# EAGLE design schemat_lite (EAGLE 8.3.0)
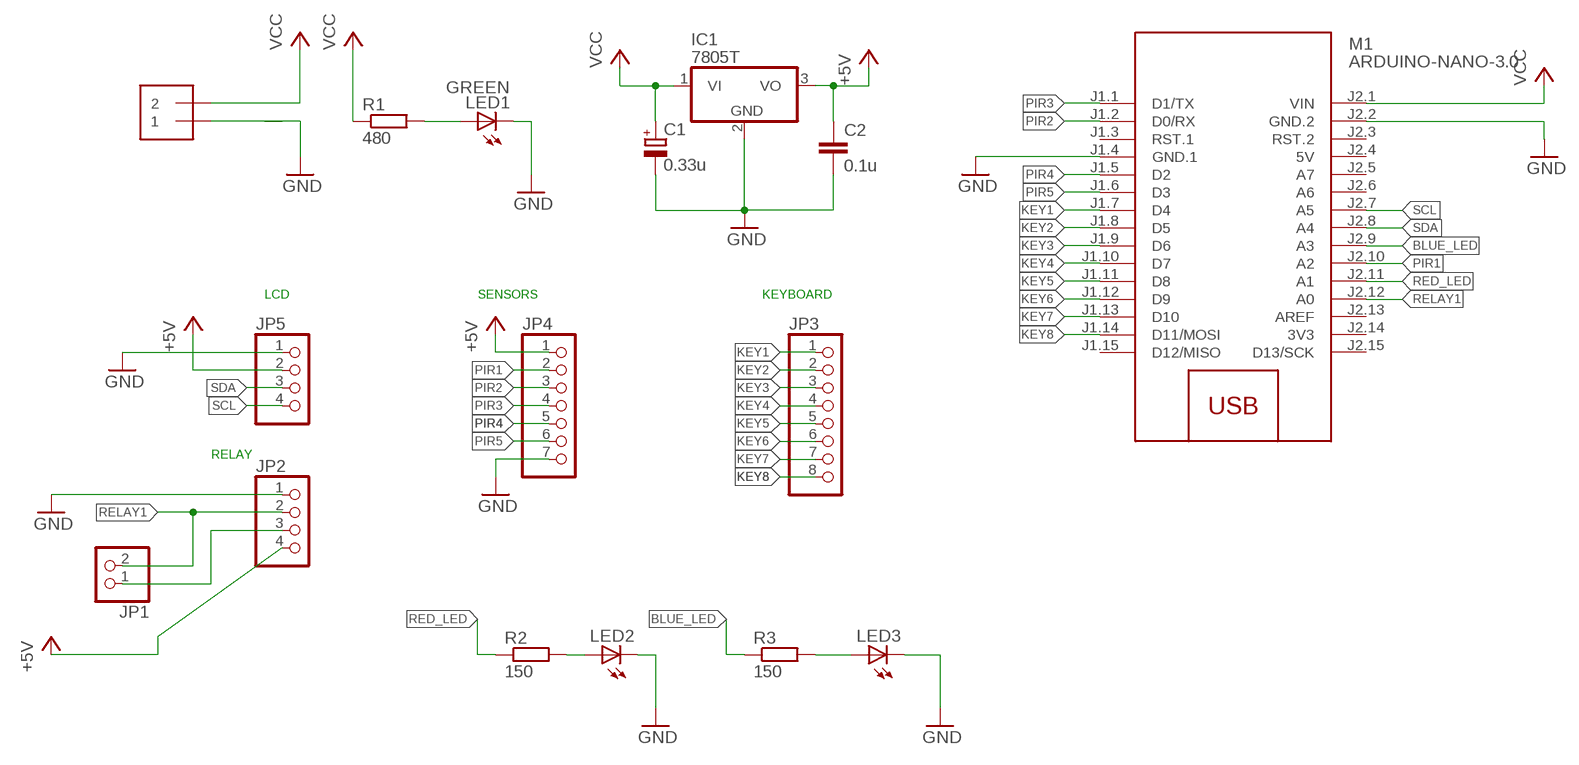
[diagram p0: schematic, sheet 1]

## Parts
C1  0.33u  CPOL-EUE5-4  [E5-4]
C2  0.1u  C-EU050-025X075  [C050-025X075]
IC1  7805T  [TO220H]
J1  1X2-3.5MM  [1X2-3.5MM]
JP1  PINHD-1X2  [1X02]
JP2  PINHD-1X4  [1X04]
JP3  PINHD-1X8  [1X08]
JP4  PINHD-1X7  [1X07]
JP5  PINHD-1X4  [1X04]
LED1  GREEN  LED5MM  [LED5MM]
LED2  LED5MM  [LED5MM]
LED3  LED5MM  [LED5MM]
M1  ARDUINO-NANO-3.0  [ARDUINO-NANO-3.0]
R1  480  R-EU_0204/7  [0204/7]
R2  150  R-EU_0204/7  [0204/7]
R3  150  R-EU_0204/7  [0204/7]

## Nets
+5V: C2.1 IC1.3(VO) JP2.4 JP4.1 JP5.2
BLUE_LED: M1.J2.9(A3) R3.1
GND: C1.- C2.2 IC1.2(GND) J1.1 JP2.1 JP4.7 JP5.1 LED1.K(C) LED2.K(C) LED3.K(C) M1.J1.4(GND.1) M1.J2.2(GND.2)
KEY1: JP3.1 M1.J1.7(D4)
KEY2: JP3.2 M1.J1.8(D5)
KEY3: JP3.3 M1.J1.9(D6)
KEY4: JP3.4 M1.J1.10(D7)
KEY5: JP3.5 M1.J1.11(D8)
KEY6: JP3.6 M1.J1.12(D9)
KEY7: JP3.7 M1.J1.13(D10)
KEY8: JP3.8 M1.J1.14(D11/MOSI)
N$1: JP1.1 JP2.3
N$2: LED1.A R1.2
N$3: LED2.A R2.2
N$4: LED3.A R3.2
PIR1: JP4.2 M1.J2.10(A2)
PIR2: JP4.3 M1.J1.2(D0/RX)
PIR3: JP4.4 M1.J1.1(D1/TX)
PIR4: JP4.5 M1.J1.5(D2)
PIR5: JP4.6 M1.J1.6(D3)
RED_LED: M1.J2.11(A1) R2.1
RELAY1: JP1.2 JP2.2 M1.J2.12(A0)
SCL: JP5.4 M1.J2.7(A5)
SDA: JP5.3 M1.J2.8(A4)
VCC: C1.+ IC1.1(VI) J1.2 M1.J2.1(VIN) R1.1
Unconnected: M1.J1.3(RST.1) M1.J1.15(D12/MISO) M1.J2.3(RST.2) M1.J2.5(A7) M1.J2.6(A6) M1.J2.13(AREF) M1.J2.15(D13/SCK)

## Notes on the sheet
- LCD | SENSORS | KEYBOARD
- RELAY

## Power pins joined to a net without a drawn wire
3V3: M1.J2.14(3V3)
5V: M1.J2.4(5V)

## Library data of the parts
C1 = resistor:CPOL-EU: POLARIZED CAPACITOR, European symbol
C2 = resistor:C-EU: CAPACITOR, European symbol
IC1 = adafruit:78*: Positive VOLTAGE REGULATOR Added bigger pads to the TO-92 package
J1 = adafruit:1X2: 3.5mm Terminal block http://www.ladyada.net/library/pcb/eaglelibrary.html
JP1 = pinhead:PINHD-1X2: PIN HEADER
JP2 JP5 = pinhead:PINHD-1X4: PIN HEADER
JP3 = pinhead:PINHD-1X8: PIN HEADER
JP4 = pinhead:PINHD-1X7: PIN HEADER
LED1-LED3 = adafruit:LED: LED OSRAM: - CHIPLED LG R971, LG N971, LY N971, LG Q971, LY Q971, LO R971, LY R971 LH N974, LH R974 LS Q976, LO Q976, LY Q976 LO Q996 - Hyper CHIPLED LW Q18S LB Q993, LB Q99A, LB R99A - SideLED LS A670, LO A670, LY A670, LG A670, LP A670 LB A673, LV A673, LT A673, LW A673 LH A674 LY A675 LS A676, LA A676, LO A676, LY A676, LW A676 LS A679, LY A679, LG A679 - Hyper Micro SIDELED® LS Y876, LA Y876, LO Y876, LY Y876 LT Y87S - SmartLED LW L88C, LW L88S LB L89C, LB L89S, LG L890 LS L89K, LO L89K, LY L89K LS L896, LA L896, LO L896, LY L896 - TOPLED LS T670, LO T670, LY T670, LG T670, LP T670 LSG T670, LSP T670, LSY T670, LOP T670, LYG T670 LG T671, LOG T671, LSG T671 LB T673, LV T673, LT T673, LW T673 LH T674 LS T676, LA T676, LO T676, LY T676, LB T676, LH T676, LSB T676, LW T676 LB T67C, LV T67C, LT T67C, LS T67K, LO T67K, LY T67K, LW E67C LS E67B, LA E67B, LO E67B, LY E67B, LB E67C, LV E67C, LT E67C LW T67C LS T679, LY T679, LG T679 LS T770, LO T770, LY T770, LG T770, LP T770 LB T773, LV T773, LT T773, LW T773 LH T774 LS E675, LA E675, LY E675, LS T675 LS T776, LA T776, LO T776, LY T776, LB T776 LHGB T686 LT T68C, LB T68C - Hyper Mini TOPLED® LB M676 - Mini TOPLED Santana® LG M470 LS M47K, LO M47K, LY M47K Source: http://www.osram.convergy.de/
M1 = diy-modules:ARDUINO-NANO-3.0: Arduino Nano 3.0 and compatible devices More details available here: https://www.arduino.cc/en/Main/ArduinoBoardNano Click here to find device on ebay.com <http://www.ebay.com/sch/arduino+nano>
R1-R3 = resistor:R-EU_: RESISTOR, European symbol

## Module FC-113
Ports: 

### Library data of the parts

## Net classes
0 default: width 0.61 mm, drill 0.508 mm, clearance 0.381 mm

## Board
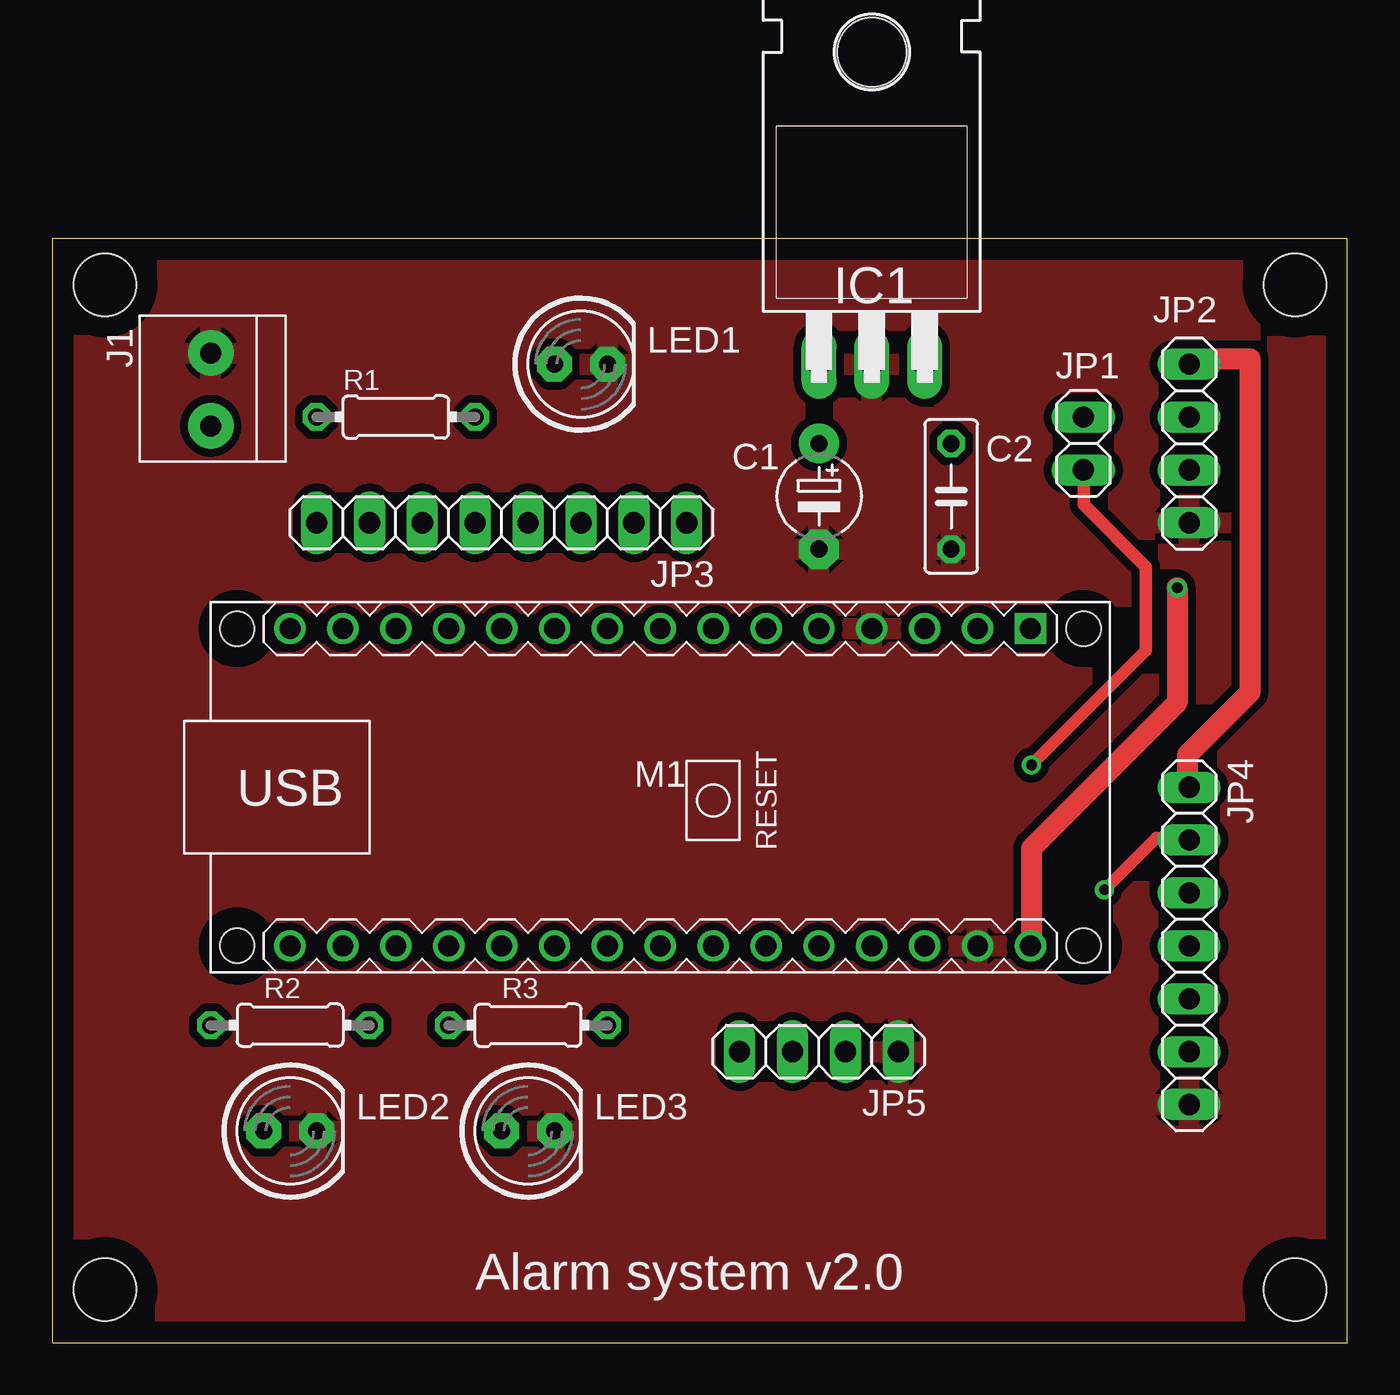
[diagram p1: board, top side]
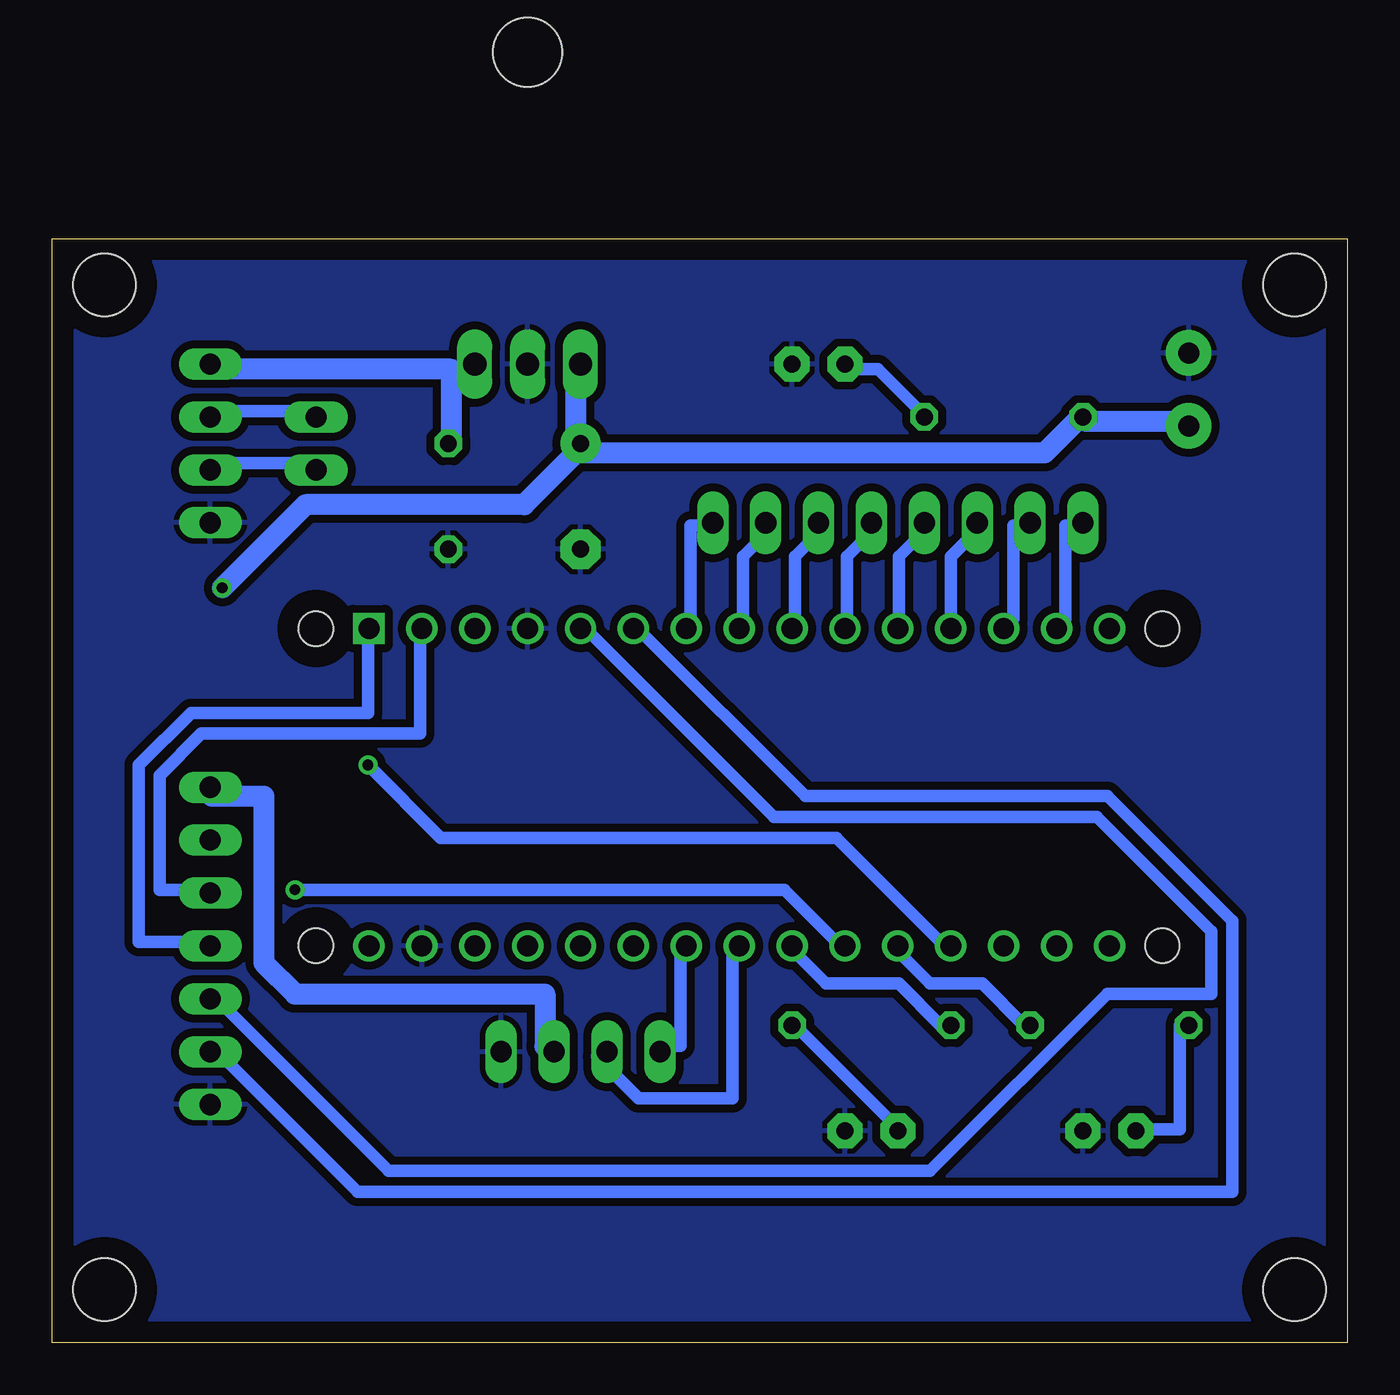
[diagram p2: board, bottom side, seen from below]

Size 62.21 x 53.01 mm. Coordinates in mm from the lower left corner, seen from the top.
Outline: 0,0 62.21,0 62.21,53.01 0,53.01 0,0
Copper layers (1*16): Top 0.035mm / dielectric 1.5mm / Bottom 0.035mm
Design rules "default": minimum track width 6mil, minimum drill 0.35mm, track to track 6mil, track to pad 6mil, pad to pad 6mil, via to via 6mil, smd to smd 6mil, copper to edge 40mil, drill to drill 6mil, minimum pad ring 10mil, minimum via ring 8mil, stop-mask expansion 4mil, vias tented up to drill 0mil, thermal gap 10mil
Holes 3 mm at 2.54,2.54 59.69,2.54 59.69,50.8 2.54,50.8

### Footprints (pad centres in the part's own frame; a part is rotated, then mirrored left to right if it is on the bottom)
E5-4 = drill 0.813 pad 1.905: + -2.54,0 | drill 0.813 pad 1.905 octagon: - 2.54,0
C050-025X075 = drill 0.813 octagon: 1 -2.54,0; 2 2.54,0
TO220H = drill 1.118 long: 1 -2.54,-10.16; 2 0,-10.16; 3 2.54,-10.16 | hole 3.302: 0,4.826
1X2-3.5MM = drill 1 pad 2.184: 1 1.8,0; 2 -1.7,0
1X02 = drill 1.016 long: 1 -1.27,0; 2 1.27,0
1X04 = drill 1.016 long: 1 -3.81,0; 2 -1.27,0; 3 1.27,0; 4 3.81,0
1X08 = drill 1.016 long: 1 -8.89,0; 2 -6.35,0; 3 -3.81,0; 4 -1.27,0; 5 1.27,0; 6 3.81,0; 7 6.35,0; 8 8.89,0
1X07 = drill 1.016 long: 1 -7.62,0; 2 -5.08,0; 3 -2.54,0; 4 0,0; 5 2.54,0; 6 5.08,0; 7 7.62,0
LED5MM = drill 0.813 pad 1.676 octagon: A -1.27,0; K 1.27,0
ARDUINO-NANO-3.0 = drill 1 square: J1.1 17.78,7.62 | drill 1: J1.2 15.24,7.62; J1.3 12.7,7.62; J1.4 10.16,7.62; J1.5 7.62,7.62; J1.6 5.08,7.62; J1.7 2.54,7.62; J1.8 0,7.62; J1.9 -2.54,7.62; J1.10 -5.08,7.62; J1.11 -7.62,7.62; J1.12 -10.16,7.62; J1.13 -12.7,7.62; J1.14 -15.24,7.62; J1.15 -17.78,7.62; J2.1 17.78,-7.62; J2.2 15.24,-7.62; J2.3 12.7,-7.62; J2.4 10.16,-7.62; J2.5 7.62,-7.62; J2.6 5.08,-7.62; J2.7 2.54,-7.62; J2.8 0,-7.62; J2.9 -2.54,-7.62; J2.10 -5.08,-7.62; J2.11 -7.62,-7.62; J2.12 -10.16,-7.62; J2.13 -12.7,-7.62; J2.14 -15.24,-7.62; J2.15 -17.78,-7.62 | hole 1.651: -20.32,7.62; -20.32,-7.62; 20.32,-7.62; 20.32,7.62
0204/7 = drill 0.813 octagon: 1 -3.81,0; 2 3.81,0

### Placement (x,y rotation side)
C1  36.83,40.64 270 top
C2  43.18,40.64 270 top
IC1  39.37,57.15 0 top
J1  7.62,45.72 90 top
JP1  49.53,43.18 270 top
JP2  54.61,43.18 90 top
JP3  21.59,39.37 180 top
JP4  54.61,19.05 270 top
JP5  36.83,13.97 180 top
LED1  25.4,46.99 0 top
LED2  11.43,10.16 0 top
LED3  22.86,10.16 0 top
M1  29.21,26.67 0 top
R1  16.51,44.45 0 top
R2  11.43,15.24 180 top
R3  22.86,15.24 0 top

### Tracks (layer width: path | path; a pad name or v marks a point on that pad's centre or on a via)
+5V
  Top 0.61: 55.04,47.24 JP2.4 | 54.54,26.74 JP4.1
  Top 1.016: 55.04,47.24 57.54,47.24 57.54,31.24 54.54,28.24 54.54,26.74
  Bottom 0.61: 43.04,46.74 42.04,46.74 IC1.3 | 43.04,43.24 C2.1 | 54.54,46.74 JP2.4 | 38.54,14.24 JP5.2 | 54.54,26.24 JP4.1
  Bottom 1.016: 43.04,43.24 43.04,46.74 54.54,46.74 | 38.54,14.24 38.54,16.74 50.54,16.74 52.04,18.24 52.04,26.24 54.54,26.24
BLUE_LED
  Bottom 0.61: R3.1 19.54,15.24 21.54,17.24 25.04,17.24 26.54,18.74 M1.J2.9
GND
  pour Top: -1.27,54.61 -1.27,-1.27 63.5,-1.27 63.5,54.61
  pour Bottom: -1.27,53.34 -1.27,-1.27 63.5,-1.27 63.5,54.61 -1.27,54.61
KEY1
  Bottom 0.61: M1.J1.7 31.54,34.74 31.54,39.24 30.54,39.24 JP3.1
KEY2
  Bottom 0.61: M1.J1.8 29.04,34.74 29.04,37.74 27.54,39.24 JP3.2
KEY3
  Bottom 0.61: M1.J1.9 26.54,34.74 26.54,37.74 25.04,39.24 JP3.3
KEY4
  Bottom 0.61: M1.J1.10 24.04,34.74 24.04,37.74 22.54,39.24 JP3.4
KEY5
  Bottom 0.61: M1.J1.11 21.54,34.74 21.54,37.74 20.04,39.24 JP3.5
KEY6
  Bottom 0.61: M1.J1.12 19.04,34.74 19.04,37.74 17.54,39.24 JP3.6
KEY7
  Bottom 0.61: M1.J1.13 16.04,34.74 16.04,39.24 15.54,39.24 JP3.7
KEY8
  Bottom 0.61: M1.J1.14 13.54,34.74 13.54,39.24 13.04,39.24 JP3.8
N$1
  Bottom 0.61: JP1.1 49.54,44.74 54.54,44.74 JP2.3
N$2
  Bottom 0.61: R1.2 20.54,44.74 22.54,46.74 24.04,46.74 LED1.A
N$3
  Bottom 0.61: R2.2 8.04,15.24 8.04,10.24 10.04,10.24 LED2.A
N$4
  Bottom 0.61: R3.2 26.54,15.24 21.54,10.24 LED3.A
PIR1  (via drill 0.51)
  Top 0.61: v50.54,21.74 53.04,24.24 54.54,24.24 JP4.2
  Bottom 0.61: v50.54,21.74 27.04,21.74 24.54,19.24 M1.J2.10
PIR2
  Bottom 0.61: M1.J1.2 44.54,34.24 44.54,29.24 55.04,29.24 57.04,27.24 57.04,21.74 55.04,21.74 JP4.3
PIR3
  Bottom 0.61: M1.J1.1 47.04,34.24 47.04,30.24 55.54,30.24 58.04,27.74 58.04,19.24 55.04,19.24 JP4.4
PIR4
  Bottom 0.61: M1.J1.5 36.54,34.24 27.54,25.24 12.04,25.24 6.54,19.74 6.54,16.74 11.54,16.74 20.04,8.24 46.04,8.24 54.04,16.24 54.54,16.24 JP4.5
PIR5
  Bottom 0.61: M1.J1.6 34.04,34.24 26.04,26.24 11.54,26.24 5.54,20.24 5.54,7.24 47.54,7.24 54.04,13.74 54.54,13.74 JP4.6
RED_LED
  Bottom 0.61: R2.1 15.54,15.24 17.54,17.24 20.04,17.24 21.54,18.74 M1.J2.11
RELAY1  (via drill 0.51)
  Top 0.61: v47.04,27.74 52.54,33.24 52.54,37.24 49.54,40.24 49.54,41.74 JP1.2
  Bottom 0.61: v47.04,27.74 43.54,24.24 24.54,24.24 19.54,19.24 M1.J2.12 | JP2.2 54.54,42.24 49.54,42.24 JP1.2
SCL
  Bottom 0.61: M1.J2.7 32.04,18.74 32.04,14.24 32.54,14.24 JP5.4
SDA
  Bottom 0.61: M1.J2.8 29.54,18.74 29.54,11.74 34.04,11.74 36.04,13.74 JP5.3
VCC  (via drill 0.51)
  Top 0.61: 47.04,19.24 M1.J2.1
  Top 1.016: 47.04,19.24 47.04,23.74 54.04,30.74 v54.04,36.24
  Bottom 0.61: 12.54,44.24 R1.1 13.04,44.24 | 8.04,44.24 J1.2 | 37.04,42.74 C1.+ | 37.04,46.74 IC1.1 | 37.04,43.24 C1.+ | 36.54,42.74 C1.+
  Bottom 1.016: 8.04,44.24 12.54,44.24 | v54.04,36.24 50.04,40.24 39.54,40.24 37.04,42.74 | 37.04,43.24 37.04,46.74 | 13.04,44.24 14.54,42.74 36.54,42.74

### Text on the board
tPlace: Alarm system v2.0